# Altium schematic sheet BBoard-JX1.SchDoc: Eval Board -  BBoard JX1 connector (Ethernet , CAN bus)
size A3; Author: O. Guinnard; Organization: imperix Ltd; Address1: Rue de l'Industrie 10; Address2: 1950 Sion; Address3: Switzerland; Address4: +41 27 552 06 60; DocumentNumber: 4; SheetNumber: 4; SheetTotal: 7
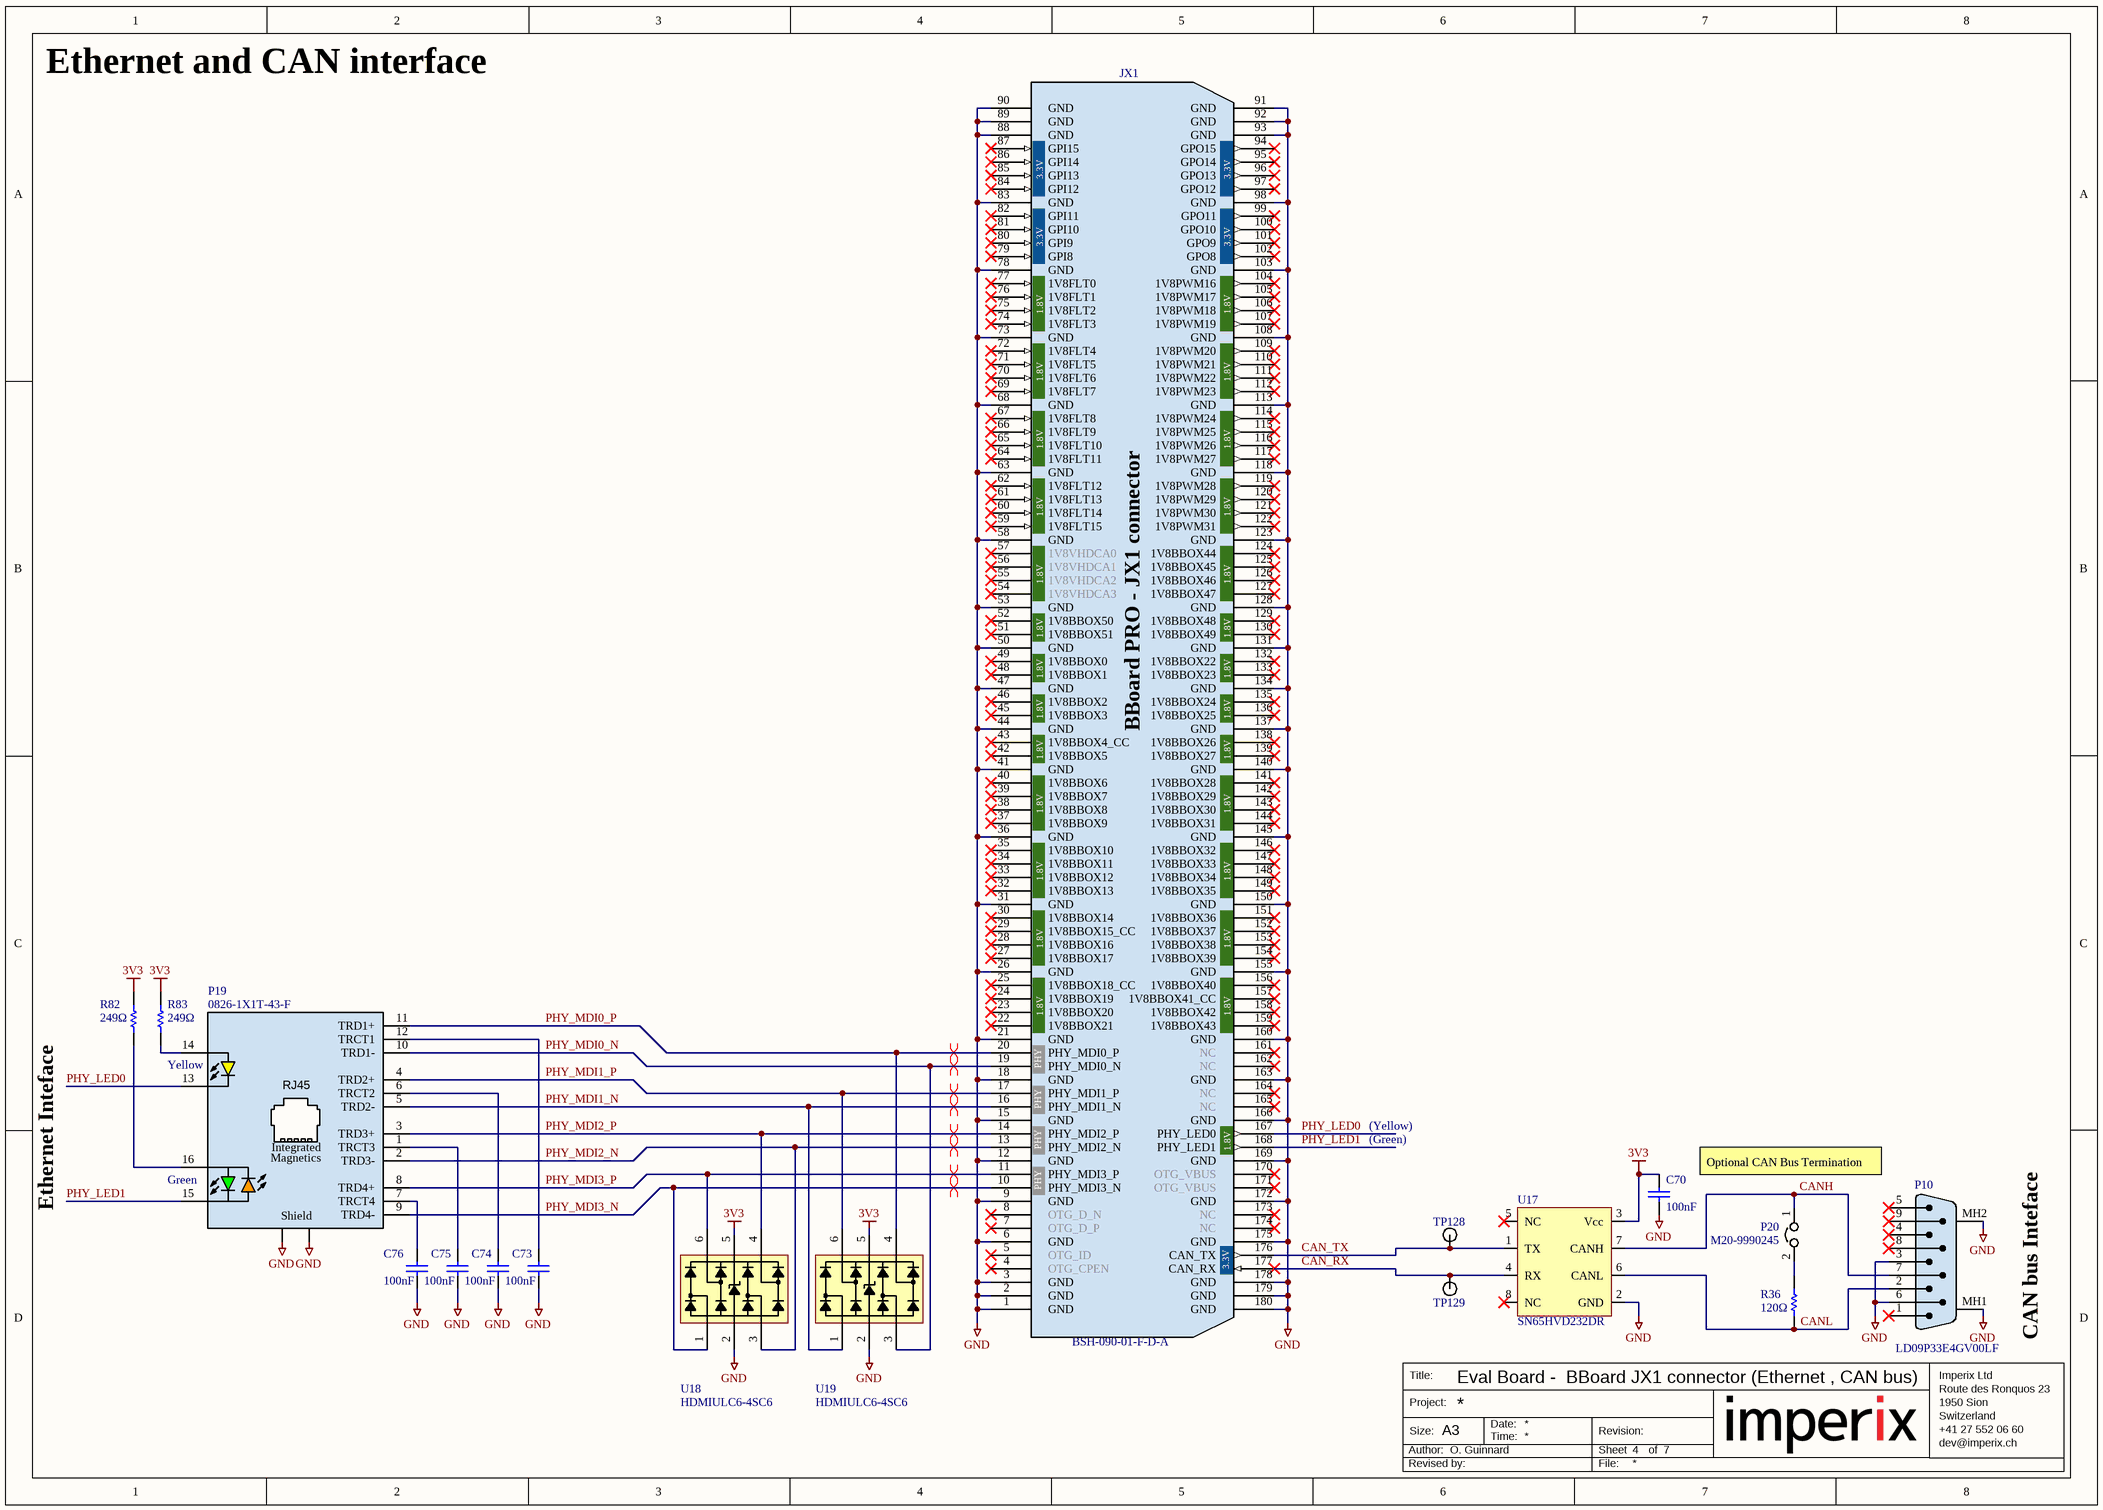
[diagram p0: BBoard-JX1.SchDoc]

## Parts
C70  value 100nF  [CAPC1005L(0402)]  (hidden comment: CAP-100NF-25V-X7R-0402-10%)
C73  value 100nF  [CAPC1005L(0402)]  (hidden comment: CAP-100NF-25V-X7R-0402-10%)
C74  value 100nF  [CAPC1005L(0402)]  (hidden comment: CAP-100NF-25V-X7R-0402-10%)
C75  value 100nF  [CAPC1005L(0402)]  (hidden comment: CAP-100NF-25V-X7R-0402-10%)
C76  value 100nF  [CAPC1005L(0402)]  (hidden comment: CAP-100NF-25V-X7R-0402-10%)
JX1  BSH-090-01-F-D-A  [BSH-090-01-F-D-A]
P10  LD09P33E4GV00LF  [LD09P33E4GV00LF]
P19  0826-1X1T-43-F  [BEL_0826-1X1T-43-F]
P20  M20-9990245  [M20-9990245]
R36  value 120Ω  [RESC1608L(0603)]  (hidden comment: RES-120Ω-1/8W-50PPM-0603-1%)
R82  value 249Ω  [RESC1005L(0402)]  (hidden comment: RES-249Ω-1/16W-100PPM-0402-1%)
R83  value 249Ω  [RESC1005L(0402)]  (hidden comment: RES-249Ω-1/16W-100PPM-0402-1%)
TP128  5001  [5001]  (value not drawn)
TP129  5001  [5001]  (value not drawn)
U17  SN65HVD232DR  [SOIC127P600-8AL]
U18  HDMIULC6-4SC6  [SOT23-6N]
U19  HDMIULC6-4SC6  [SOT23-6N]

## Nets
3V3: C70.2 R82.2 R83.2 U17.3(Vcc) U18.5 U19.5
GND: C70.1 C73.1 C74.1 C75.1 C76.1 JX1.1(GND) JX1.2(GND) JX1.3(GND) JX1.6(GND) JX1.9(GND) JX1.12(GND) JX1.15(GND) JX1.18(GND) JX1.21(GND) JX1.26(GND) JX1.31(GND) JX1.36(GND) JX1.41(GND) JX1.44(GND) JX1.47(GND) JX1.50(GND) JX1.53(GND) JX1.58(GND) JX1.63(GND) JX1.68(GND) JX1.73(GND) JX1.78(GND) JX1.83(GND) JX1.88(GND) JX1.89(GND) JX1.90(GND) JX1.91(GND) JX1.92(GND) JX1.93(GND) JX1.98(GND) JX1.103(GND) JX1.108(GND) JX1.113(GND) JX1.118(GND) JX1.123(GND) JX1.128(GND) JX1.131(GND) JX1.134(GND) JX1.137(GND) JX1.140(GND) JX1.145(GND) JX1.150(GND) JX1.155(GND) JX1.160(GND) JX1.163(GND) JX1.166(GND) JX1.169(GND) JX1.172(GND) JX1.175(GND) JX1.178(GND) JX1.179(GND) JX1.180(GND) P10.3 P10.6 P10.MH1(SH) P10.MH2(SH) P19.S1(SHIELD) P19.S2(SHIELD) U17.2(GND) U18.2 U19.2
CAN_RX: JX1.177(CAN_RX) TP129.1(TP) U17.4(RX)
CAN_TX: JX1.176(CAN_TX) TP128.1(TP) U17.1(TX)
CANH: P10.7 P20.1 U17.7(CANH)
CANL: P10.2 R36.1 U17.6(CANL)
PHY_LED0: JX1.167(PHY_LED0) P19.13
PHY_LED1: JX1.168(PHY_LED1) P19.15
PHY_MDI0_N: JX1.19(PHY_MDI0_N) P19.10(TRD1-) U19.3
PHY_MDI0_P: JX1.20(PHY_MDI0_P) P19.11(TRD1+) U19.4
PHY_MDI1_N: JX1.16(PHY_MDI1_N) P19.5(TRD2-) U19.1
PHY_MDI1_P: JX1.17(PHY_MDI1_P) P19.4(TRD2+) U19.6
PHY_MDI2_N: JX1.13(PHY_MDI2_N) P19.2(TRD3-) U18.3
PHY_MDI2_P: JX1.14(PHY_MDI2_P) P19.3(TRD3+) U18.4
PHY_MDI3_N: JX1.10(PHY_MDI3_N) P19.9(TRD4-) U18.1
PHY_MDI3_P: JX1.11(PHY_MDI3_P) P19.8(TRD4+) U18.6
NetC73_2: C73.2 P19.12(TRCT1)
NetC74_2: C74.2 P19.6(TRCT2)
NetC75_2: C75.2 P19.1(TRCT3)
NetC76_2: C76.2 P19.7(TRCT4)
NetP19_14: P19.14 R83.1
NetP19_16: P19.16 R82.1
NetP20_2: P20.2 R36.2

Not connected (* = marked no-connect by the designer): JX1 4(OTG_CPEN)* 5(OTG_ID)* 7(OTG_D_P)* 8(OTG_D_N)* 22(1V8BBOX21)* 23(1V8BBOX20)* 24(1V8BBOX19)* 25(1V8BBOX18_CC)* 27(1V8BBOX17)* 28(1V8BBOX16)* 29(1V8BBOX15_CC)* 30(1V8BBOX14)* 32(1V8BBOX13)* 33(1V8BBOX12)* 34(1V8BBOX11)* 35(1V8BBOX10)* 37(1V8BBOX9)* 38(1V8BBOX8)* 39(1V8BBOX7)* 40(1V8BBOX6)* 42(1V8BBOX5)* 43(1V8BBOX4_CC)* 45(1V8BBOX3)* 46(1V8BBOX2)* 48(1V8BBOX1)* 49(1V8BBOX0)* 51(1V8BBOX51)* 52(1V8BBOX50)* 54(1V8VHDCA3)* 55(1V8VHDCA2)* 56(1V8VHDCA1)* 57(1V8VHDCA0)* 59(1V8FLT15)* 60(1V8FLT14)* 61(1V8FLT13)* 62(1V8FLT12)* 64(1V8FLT11)* 65(1V8FLT10)* 66(1V8FLT9)* 67(1V8FLT8)* 69(1V8FLT7)* 70(1V8FLT6)* 71(1V8FLT5)* 72(1V8FLT4)* 74(1V8FLT3)* 75(1V8FLT2)* 76(1V8FLT1)* 77(1V8FLT0)* 79(GPI8)* 80(GPI9)* 81(GPI10)* 82(GPI11)* 84(GPI12)* 85(GPI13)* 86(GPI14)* 87(GPI15)* 94(GPO15)* 95(GPO14)* 96(GPO13)* 97(GPO12)* 99(GPO11)* 100(GPO10)* 101(GPO9)* 102(GPO8)* 104(1V8PWM16)* 105(1V8PWM17)* 106(1V8PWM18)* 107(1V8PWM19)* 109(1V8PWM20)* 110(1V8PWM21)* 111(1V8PWM22)* 112(1V8PWM23)* 114(1V8PWM24)* 115(1V8PWM25)* 116(1V8PWM26)* 117(1V8PWM27)* 119(1V8PWM28)* 120(1V8PWM29)* 121(1V8PWM30)* 122(1V8PWM31)* 124(1V8BBOX44)* 125(1V8BBOX45)* 126(1V8BBOX46)* 127(1V8BBOX47)* 129(1V8BBOX48)* 130(1V8BBOX49)* 132(1V8BBOX22)* 133(1V8BBOX23)* 135(1V8BBOX24)* 136(1V8BBOX25)* 138(1V8BBOX26)* 139(1V8BBOX27)* 141(1V8BBOX28)* 142(1V8BBOX29)* 143(1V8BBOX30)* 144(1V8BBOX31)* 146(1V8BBOX32)* 147(1V8BBOX33)* 148(1V8BBOX34)* 149(1V8BBOX35)* 151(1V8BBOX36)* 152(1V8BBOX37)* 153(1V8BBOX38)* 154(1V8BBOX39)* 156(1V8BBOX40)* 157(1V8BBOX41_CC)* 158(1V8BBOX42)* 159(1V8BBOX43)* 161(NC)* 162(NC)* 164(NC)* 165(NC)* 170(OTG_VBUS)* 171(OTG_VBUS)* 173(NC)* 174(NC)*; P10 1* 4* 5* 8* 9*; U17 5(NC)* 8(NC)*

## Layout directives
differential pair: PHY_MDI0_N, PHY_MDI0_P, PHY_MDI1_N, PHY_MDI1_P, PHY_MDI2_N, PHY_MDI2_P, PHY_MDI3_N, PHY_MDI3_P

## Notes on the sheet
- Ethernet and CAN interface
- Ethernet Inteface
- (near P19) Yellow
- (Yellow)
- (near P19) Green
- (Green)
- Optional CAN Bus Termination
- CAN bus Inteface
- Title:
- Imperix Ltd
- Route des Ronquos 23
- Author:
- Project:
- Size:
- A3
- Date:
- Time:
- Revision:
- Sheet
- of
- 1950 Sion
- Switzerland
- +41 27 552 06 60
- dev@imperix.ch
- Revised by:
- File:
- (in symbol CMP-070-000035-8) 3.3V; 1.8V; BBoard PRO - JX1 connector; PHY
- (in symbol CMP-265-000000-4) Integrated; Magnetics; Shield

## Library data of the parts
C70 C73-C76 = CMP-004-000006-18: CAP CER 100NF 25V X7R 0402 10% (Generic Imperix Component); Tolerance: 10%; Case/Package: 0402; Dielectric: X7R; Voltage Rating (DC): 25V
JX1 = CMP-070-000035-8: JX1 for BBoard; Max Current Rating: 1.25A; Gender: Female; Number of Contacts: 180; Pitch: 0.5mm; Mated Stacking Heights: 5mm; Max Voltage Rating (AC): 125V; Min Operating Temperature: -55°C; RoHS Compliant: Yes; Number of Rows: 2; Max Operating Temperature: 125°C; Radiation Hardening: No; Packaging: Bulk; Termination: Solder; Height: 3.25mm; Orientation: Straight; Depth: 7.24mm; Series: BSH; Housing Material: Polymer; Length: 51.27mm; Mounting Technology: Surface Mount; Number of Positions: 180; Contact Material: Bronze; Contact Plating: Gold
P10 = CMP-255-000000-9: Conn D-Subminiature PIN 9 POS 2.74mm Solder RA Thru-Hole 9 Terminal 1 Port; Manufacturer_Name: Amphenol Communications Solutions; Connector Type: D-Sub,Plug; Voltage Rating: 250V; Geometry.Height: 12.96mm; Number of Positions: 9; Current Rating: 5A; Design Item ID: LD09P33E4GV00LF; Min Operating Temperature: -55°C; Number of Rows: 2; Housing Material: Thermoplastic; Color: Black; Contact Type: Signal; Series: LD; Mounting Technology: Through Hole; Contact Plating: Gold; Termination: Solder; Manufacturer_Part_Number: LD09P33E4GV00LF; Packaging: Bulk; Max Operating Temperature: 105°C
P19 = CMP-265-000000-4: Conn Modular Jack RCP 12 POS 2.03mm Solder RA Thru-Hole 16 Terminal 1 Port Tray; Number of Ports: 1; Direction: Up; Number of Positions Loaded: 12; Shielding: Shielded; Number of Cores per Jack: 8; Gender: Female; Connector Type: RJ45; Orientation: Right Angle; Pitch: 2.03mm; Availability: Unavailable; Series: MagJack®; Value: 0826-1X1T-43-F; Packaging: Tray; Pin Count: 18; Color: Green,Orange,Yellow; Max Operating Temperature: 70°C; Depth: 15.01mm; Number of Contacts: 12; Housing Material: Polyamide; Design Item ID: 0826-1X1T-43-F; Component Type: Standard; Length: 19.15mm; Min Operating Temperature: 0°C; Termination: Solder; Number of Rows: 1; Contact Material: Copper Alloy; Mounting Technology: Through Hole; Contact Plating: Gold
P20 = CMP-070-000025-6: Connector Header Through Hole 2 position 0.100" (2.54mm); Max Current Rating: 3A; Voltage Rating (AC): 750V; Number of Contacts: 2; Contact Resistance: 25mR; Gender: Male; Insulation Resistance: 10GR; Mating Cycles: 300; Mated Stacking Heights: 16.54mm; Voltage: 50V; Packaging: Bulk; Min Operating Temperature: -40°C; Series: M20; Contact Material: Brass,Bronze; Number of Rows: 1; Housing Material: Nylon; Housing Color: Black; Termination: Solder; Contact Plating: Gold; Mounting Technology: Through Hole; Contact Type: Male Pin; Pitch: 2.54mm; Number of Positions: 2; Max Operating Temperature: 105°C; Reach SVHC Compliant: No; Length: 5.08mm; Radiation Hardening: No; Current Rating: 3A; Package Quantity: 1000; Orientation: Straight; Depth: 2.54mm; Fastening Type: Pull; Insulation Color: Black; Flammability Rating: UL94 V-0; Lead Pitch: 2.54mm; Insulation Material: Nylon; Contact Finish - Mating: GOLD; Current: 3A; Voltage Rating (DC): 750V; Number of Poles: 2; Contact Shape: Square; Working Voltage: 750V
R36 = CMP-006-000016-3: RES SMD 120Ω 1/8W 50PPM 0603 1% (Generic Imperix Component); Temperature Coefficient: 50ppm/°C; Tolerance: 1%; Case/Package: 0603; Power Rating: 1/8W
R82 R83 = CMP-132-000003-2: RES SMD 249Ω 1/16W 100PPM 0402 1% (Generic Imperix Component); Temperature Coefficient: 100ppm/°C; Power Rating: 1/16W; Tolerance: 1%; Case/Package: 0402
TP128 TP129 = CMP-049-000000-14: Black PC Test Point, Miniature Phosphor Bronze Silver Plating Through Hole Mounting Type; Hole Diameter: 1.6mm; Inside Diameter: 1.27mm; Outside Diameter: 2.54mm; Number of Contacts: 1; Insulation: Insulated; Body Material: Bronze; Color: Black; Contact Material: Bronze; Contact Plating: Tin,Silver; Lead Free: Lead Free; Length: 7.62mm; Material: Nylon,Bronze,Silver; Mounting Technology: Through Hole; Package Quantity: 100; Packaging: Bulk; Reach SVHC Compliant: No; RoHS Compliant: Yes; Series: THM; Insulation Material: Nylon; Housing Color: Black; Orientation: Straight; Diameter: 2.54mm; Termination: Through Hole; Number of Ports: 1; Plating: Silver
U17 = CMP-00049-3: Texas Instruments - SN65HVD232DR - Can Transceiver, 1MBPS, 1/1, 3.3V, SOIC-8, Full Reel; Number of Receive Buffers: 1; Min Supply Voltage: 3V; Max Supply Voltage: 3.6V; Simplex/Duplex: Half Duplex; Supply Current: 17mA; Receiver Hysteresis: 100mV; Weight: 0.002561oz; Radiation Hardening: No; RoHS Compliant: Yes; Series: -; Pins: 8; Data Rate: 1Mbps; Package Quantity: 2500; Max Operating Temperature: 85°C; Reach SVHC Compliant: No; Case/Package: SOIC-8; Number of Receivers: 1; Number of Transmit Buffers: 1; Number of Drivers: 1; Lead Free: Lead Free; Min Operating Temperature: -40°C; Number of Transceivers: 1; Packaging: Tape and Reel
U18 U19 = CMP-050-000000-12: HDMIULC6 Series 4 Channel 6 V Bi-Directional ESD Protection - SOT-23-6; Breakdown Voltage: 6V; Clamping Voltage-Max: 17V; Direction: Unidirectional,Bidirectional; ESD Protection: Yes; Leakage Current: 500nA; Number of Bidirectional Channels: 4; Number of Elements: 1; Operating Supply Voltage: 5V; Peak Pulse Current: 5A; Polarity: Bidirectional,Unidirectional; Test Current: 1mA; Value: 1pF; Case/Package: SOT23-6; Clamping Voltage: 17V; Depth: 1.75mm; Height: 1.3mm; Lead Free: Lead Free; Length: 3.05mm; Max Breakdown Voltage: 6V; Max Operating Temperature: 125°C; Max Reverse Leakage Current: 500nA; Min Breakdown Voltage: 6V; Min Operating Temperature: -55°C; Mounting Technology: Surface Mount; Number of Channels: 4; Number of Unidirectional Channels: 4; Package Quantity: 1; Packaging: Tape and Reel; Pins: 6; Power Line Protection: Yes; Radiation Hardening: No; Reach SVHC Compliant: No; Reverse Breakdown Voltage: 6V; Reverse Standoff Voltage: 5V; RoHS Compliant: Yes; Series: HDMI; Termination: SMD/SMT; Voltage Rating (DC): 6V; Width: 1.75mm; Working Voltage: 5V